# EasyEDA schematic Klingel.json
TITLE: Kartenleser Haustür; REV: 1.0; Date: 2023-05-02; Sheet: 1/1; Company: Your Company
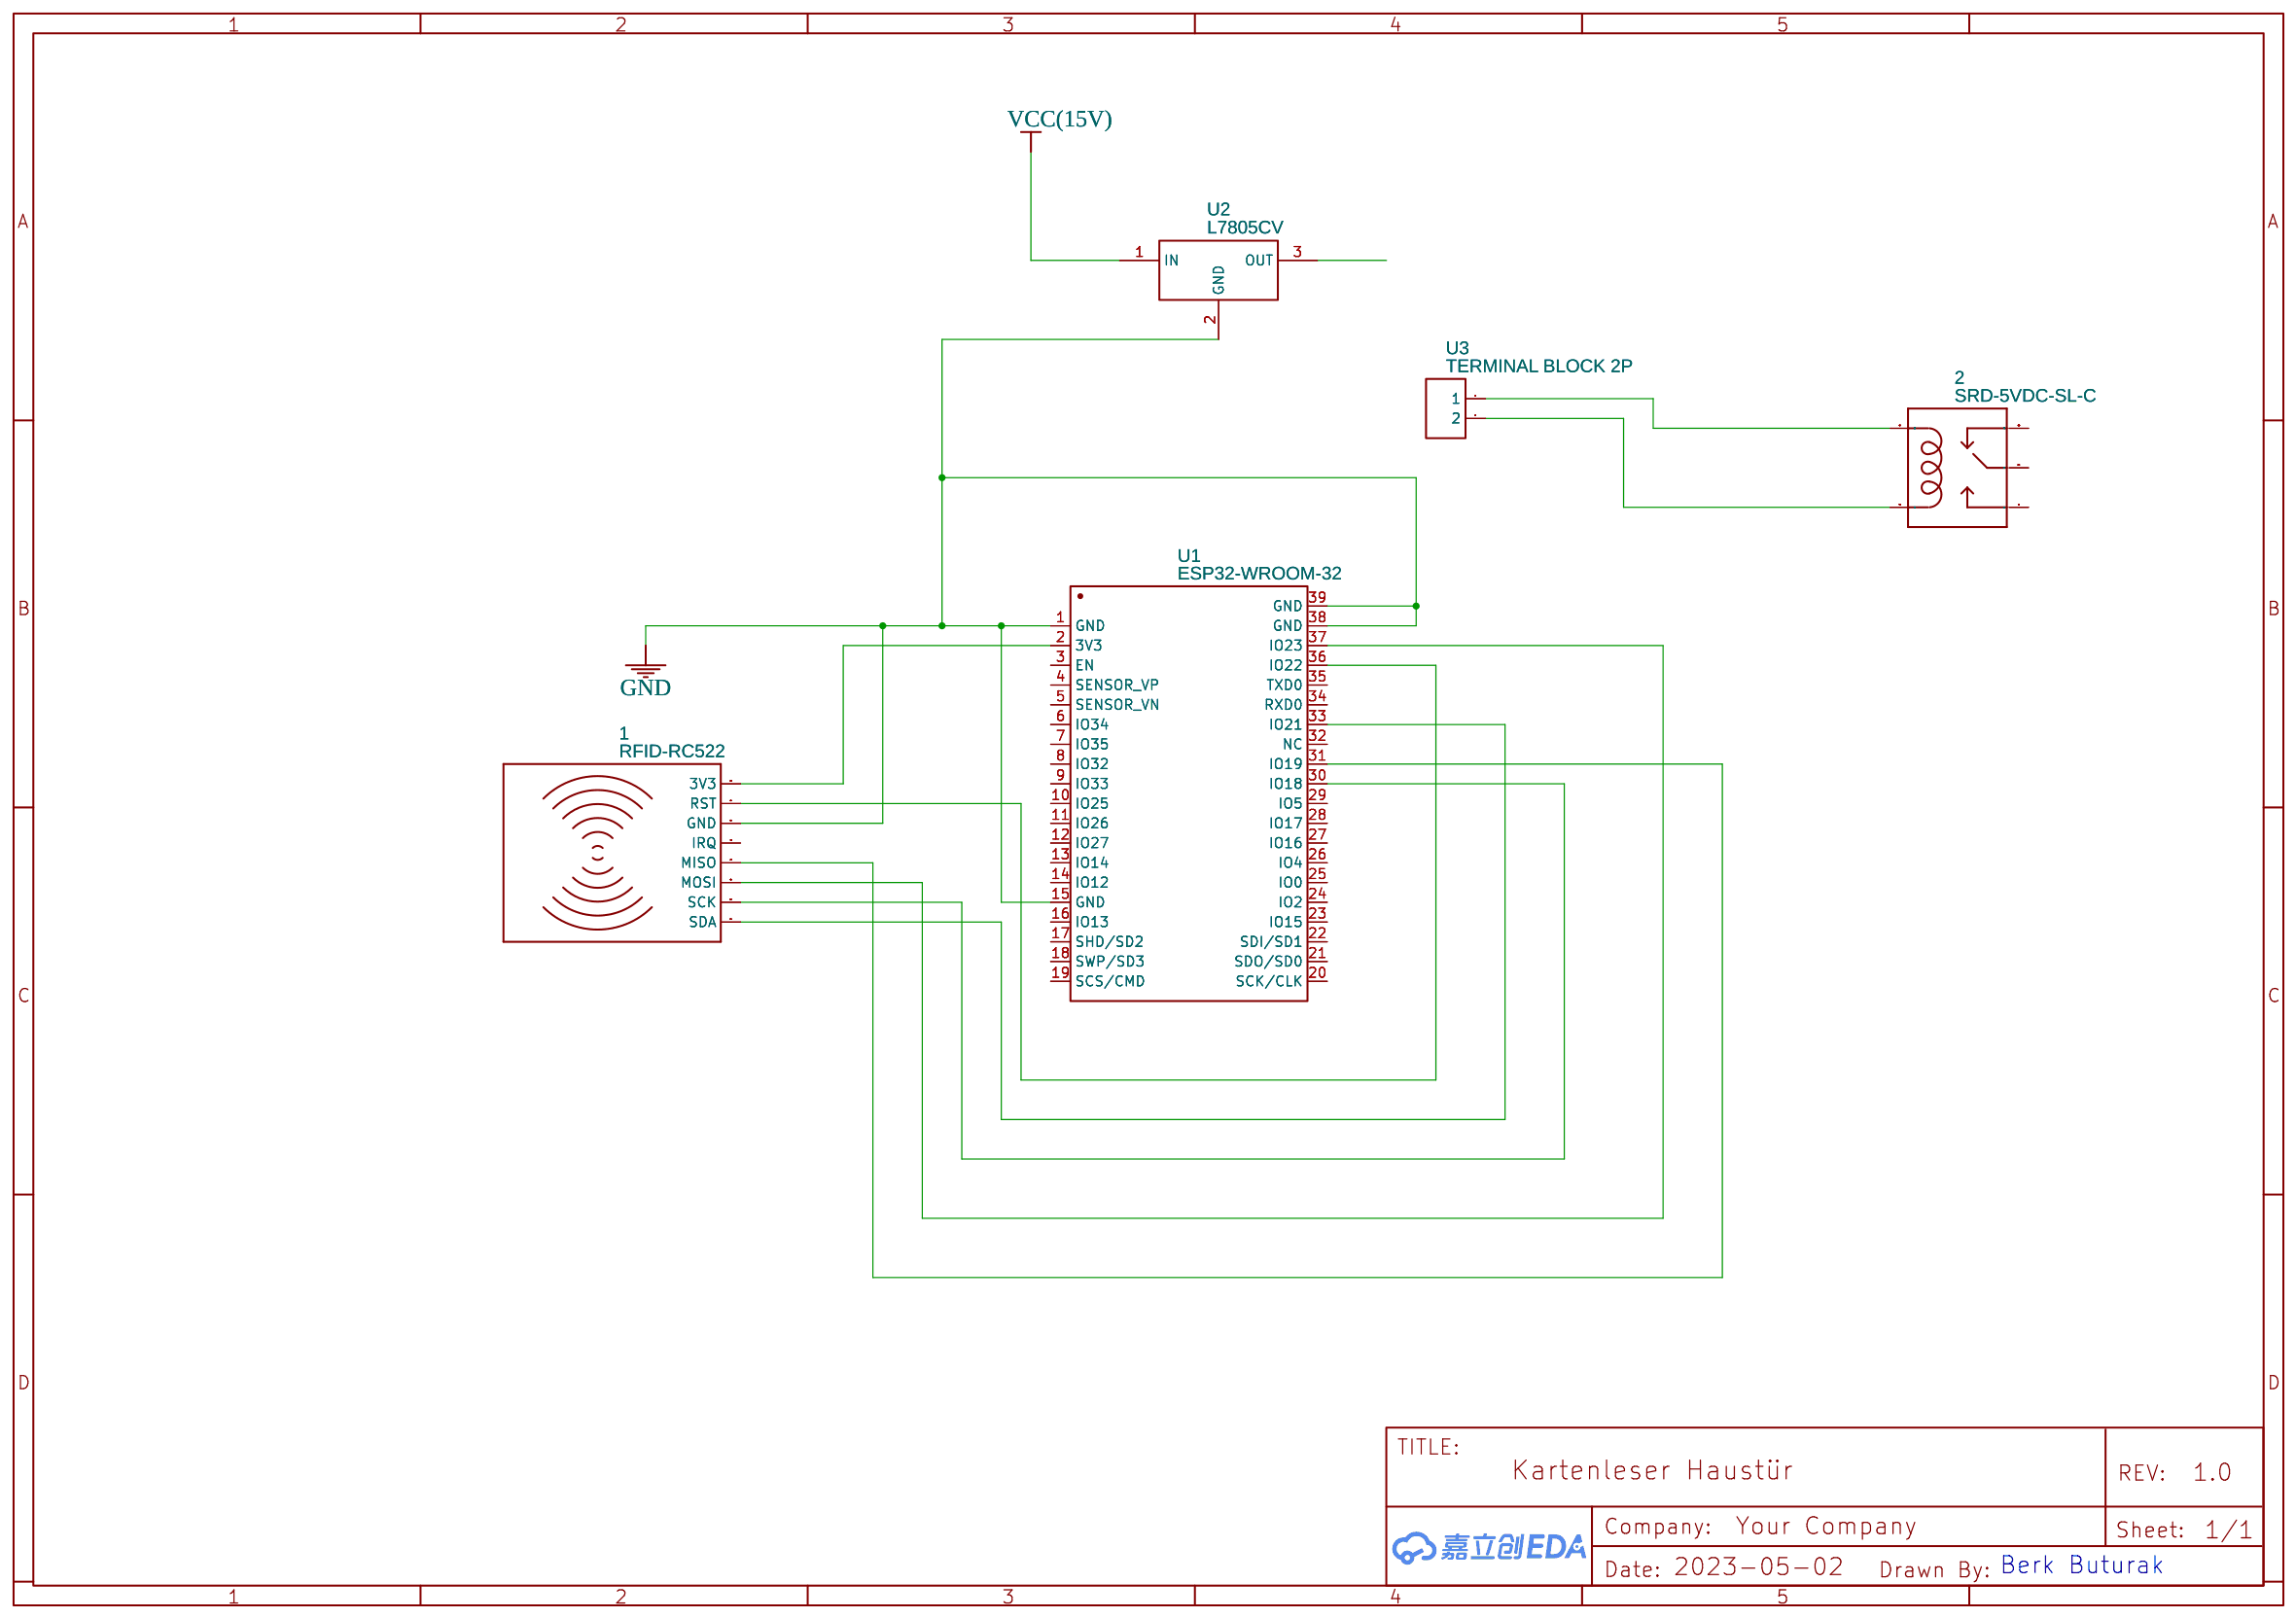
[diagram p0: schematic sheet]

## Parts
1  RFID-RC522  [RFID-RC522]
2  SRD-5VDC-SL-C  [SRD-5VDC-SL-C]
U1  ESP32-WROOM-32  [WIFIM-SMD_ESP32-WROOM-32-N4]
U2  L7805CV  [TO-220-3_L10.0-W4.5-P2.54-L]
U3  TERMINAL BLOCK 2P  [BORNERA DOS TERMINALES TERMINAL BLOCK 5MM]

## Library data of the parts
1 = RFID-RC522: Contributor: Nate Morgret
2 = SRD-5VDC-SL-C: Contributor: Paul Bruce
U1 = ESP32-WROOM-32: Supplier: LCSC; Supplier Part: C82899; Manufacturer: ESPRESSIF(乐鑫); Manufacturer Part: ESP32-WROOM-32-N4; Contributor: LCSC; JLCPCB Part Class: Extended Part
U2 = L7805CV: Supplier: LCSC; Manufacturer: ST(意法半导体); Supplier Part: C111887; JLCPCB Part Class: Extended Part
U3 = TERMINAL BLOCK 2P: Contributor: Егор Миропольцев

## Nets
GND: 1.GND U1.1(GND) U1.15(GND) U1.38(GND) U1.39(GND) U2.2(GND)
VCC(15V): U2.1(IN)
Net-(1-3V3): 1.3V3 U1.2(3V3)
Net-(1-MISO): 1.MISO U1.31(IO19)
Net-(1-MOSI): 1.MOSI U1.37(IO23)
Net-(1-RST): 1.RST U1.36(IO22)
Net-(1-SCK): 1.SCK U1.30(IO18)
Net-(1-SDA): 1.SDA U1.33(IO21)
Net-(2-COIL1): 2.COIL1 U3.1
Net-(2-COIL2): 2.COIL2 U3.2

Not connected (* = marked no-connect by the designer): 1 IRQ; 2 CLOSED(NC) COMMON(MAIN) OPEN(NO); U1 3(EN) 4(SENSOR_VP) 5(SENSOR_VN) 6(IO34) 7(IO35) 8(IO32) 9(IO33) 10(IO25) 11(IO26) 12(IO27) 13(IO14) 14(IO12) 16(IO13) 17(SHD/SD2) 18(SWP/SD3) 19(SCS/CMD) 20(SCK/CLK) 21(SDO/SD0) 22(SDI/SD1) 23(IO15) 24(IO2) 25(IO0) 26(IO4) 27(IO16) 28(IO17) 29(IO5) 32(NC) 34(RXD0) 35(TXD0); U2 3(OUT)

## Notes on the sheet
- Berk Buturak
